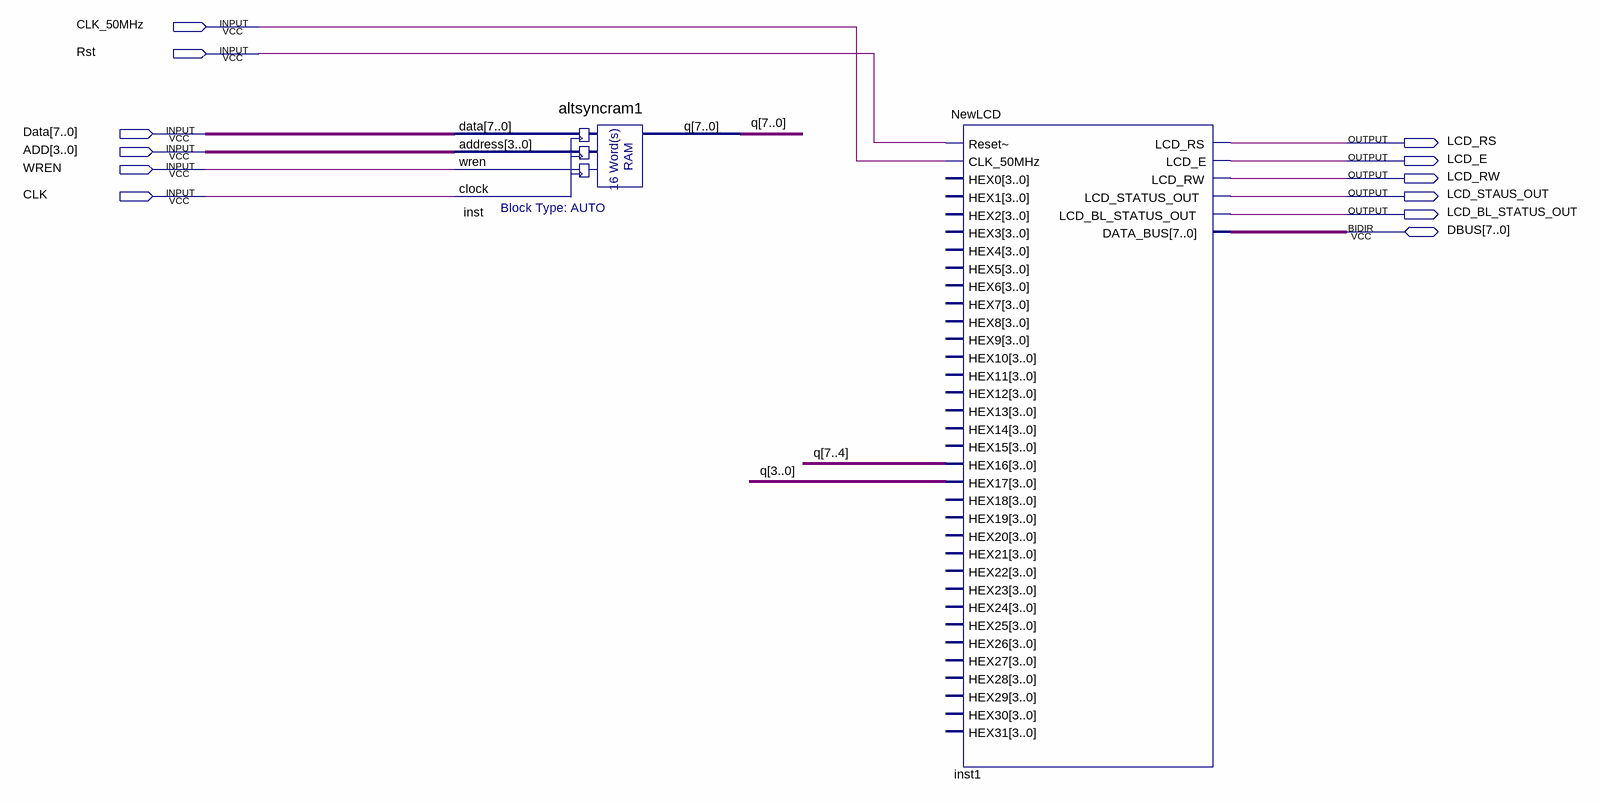
[diagram p0: schematic sheet]
// Quartus schematic ALTSYNCRAM15.bdf as structural Verilog: 2 symbols, 12 pins
module ALTSYNCRAM15 (
  input  CLK_50MHz,
  input  Rst,
  input  [7:0] Data,
  input  [3:0] ADD,
  input  WREN,
  input  CLK,
  inout  [7:0] DBUS,
  output LCD_RS,
  output LCD_E,
  output LCD_RW,
  output LCD_STAUS_OUT,
  output LCD_BL_STATUS_OUT
);

  wire [7:0] q;

  altsyncram1 inst (.data(Data), .address(ADD), .wren(WREN), .clock(CLK), .q(q));
  NewLCD inst1 (
    .\Reset~ (Rst), .CLK_50MHz(CLK_50MHz), .HEX16(q[7:4]), .HEX17(q[3:0]), .LCD_RS(LCD_RS), .LCD_E(LCD_E),
    .LCD_RW(LCD_RW), .LCD_STATUS_OUT(LCD_STAUS_OUT), .LCD_BL_STATUS_OUT(LCD_BL_STATUS_OUT), .DATA_BUS(DBUS));  // open: HEX0, HEX1, HEX2, HEX3, HEX4, HEX5, HEX6, HEX7, HEX8, HEX9, HEX10, HEX11, HEX12, HEX13, HEX14, HEX15, HEX18, HEX19, HEX20, HEX21, HEX22, HEX23, HEX24, HEX25, HEX26, HEX27, HEX28, HEX29, HEX30, HEX31
endmodule
